# EAGLE design NANOmax (EAGLE 9.6.2)
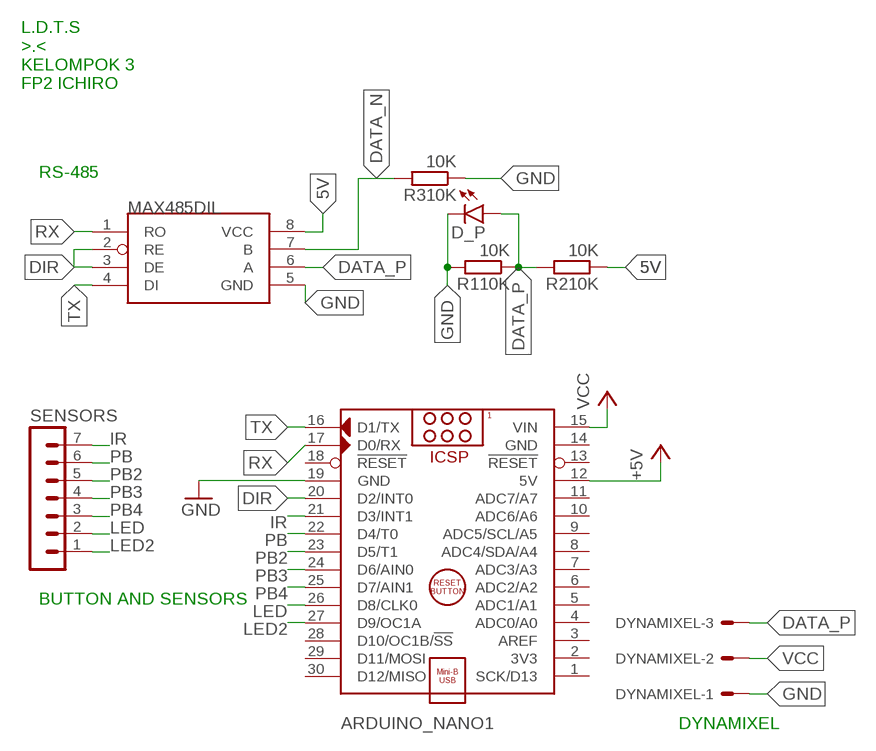
[diagram p0: schematic, sheet 1]

## Parts
ARDUINO_NANO1  ARDUINO_NANO  [ARDUINO_NANO]
D_P  LED3MM  [LED3MM]
DYNAMIXEL  22-27-2031-03  [6410-03]
MAX485  MAX485DIL  [DIL08]
R110K  10K  R-EU_0204/7  [0204/7]
R210K  10K  R-EU_0204/7  [0204/7]
R310K  10K  R-EU_0204/7  [0204/7]
SENSORS  MA07-1  [MA07-1]

## Nets
5V: MAX485.8(VCC) R210K.1
+5V: ARDUINO_NANO1.12(5V)
DATA_N: MAX485.7(B) R310K.2
DATA_P: D_P.A DYNAMIXEL.3 MAX485.6(A) R110K.1 R210K.2
DIR: ARDUINO_NANO1.20(D2/INT0) MAX485.2(RE) MAX485.3(DE)
GND: ARDUINO_NANO1.19(GND) D_P.K(C) DYNAMIXEL.1 MAX485.5(GND) R110K.2 R310K.1
IR: ARDUINO_NANO1.21(D3/INT1) SENSORS.7
LED: ARDUINO_NANO1.26(D8/CLK0) SENSORS.2
LED2: ARDUINO_NANO1.27(D9/OC1A) SENSORS.1
PB: ARDUINO_NANO1.22(D4/T0) SENSORS.6
PB2: ARDUINO_NANO1.23(D5/T1) SENSORS.5
PB3: ARDUINO_NANO1.24(D6/AIN0) SENSORS.4
PB4: ARDUINO_NANO1.25(D7/AIN1) SENSORS.3
RX: ARDUINO_NANO1.17(D0/RX) MAX485.1(RO)
TX: ARDUINO_NANO1.16(D1/TX) MAX485.4(DI)
VCC: ARDUINO_NANO1.15(VIN) DYNAMIXEL.2
Unconnected: ARDUINO_NANO1.1(SCK/D13) ARDUINO_NANO1.2(3V3) ARDUINO_NANO1.3(AREF) ARDUINO_NANO1.4(ADC0/A0) ARDUINO_NANO1.5(ADC1/A1) ARDUINO_NANO1.6(ADC2/A2) ARDUINO_NANO1.7(ADC3/A3) ARDUINO_NANO1.8(ADC4/SDA/A4) ARDUINO_NANO1.9(ADC5/SCL/A5) ARDUINO_NANO1.10(ADC6/A6) ARDUINO_NANO1.11(ADC7/A7) ARDUINO_NANO1.13(!RESET) ARDUINO_NANO1.18(!RESET) ARDUINO_NANO1.28(D10/OC1B/!SS) ARDUINO_NANO1.29(D11/MOSI) ARDUINO_NANO1.30(D12/MISO)

## Notes on the sheet
- L.D.T.S
  >.<
  KELOMPOK 3
  FP2 ICHIRO
- RS-485
- BUTTON AND SENSORS
- DYNAMIXEL

## Power pins joined to a net without a drawn wire
GND: ARDUINO_NANO1.14(GND)

## Library data of the parts
ARDUINO_NANO1 = ArduinoNanoV30:ARDUINO_NANO: Arduino Nano V3.0 Module Overview: The Arduino Nano is a small, complete, and breadboard-friendly board based on the ATmega328 (Arduino Nano 3.x) or ATmega168 (Arduino Nano 2.x). It has more or less the same functionality of the Arduino Duemilanove, but in a different package. It lacks only a DC power jack, and works with a Mini-B USB cable instead of a standard one. The Nano was designed and is being produced by Gravitech <http://www.gravitech.us/arna30wiatp.html>. General specifications: Item Value Microcontroller Atmel ATmega168 or ATmega328 Operating Voltage (logic level) 5 V Input Voltage (recommended) 7-12 V Input Voltage (limits) 6-20 V Digital I/O Pins 14 (of which 6 provide PWM output) Analog Input Pins 8 DC Current per I/O Pin 40 mA Flash Memory 16 KB (ATmega168) or 32 KB (ATmega328) of which 2 KB used by bootloader SRAM 1 KB (ATmega168) or 2 KB (ATmega328) EEPROM 512 bytes (ATmega168) or 1 KB (ATmega328) Clock Speed 16 MHz Dimensions (Inches) 0.73" x 1.70" Dimensions (mm) 18mm x 45mm Overall height About 9 mm (not including pins) Weigth 5 g Power: The Arduino Nano can be powered via the Mini-B USB connection, 6-20V unregulated external power supply (pin 30), or 5V regulated external power supply (pin 27). The power source is automatically selected to the highest voltage source. Memory: The ATmega168 has 16 KB of flash memory for storing code (of which 2 KB is used for the bootloader); the ATmega328 has 32 KB, (also with 2 KB used for the bootloader). The ATmega168 has 1 KB of SRAM and 512 bytes of EEPROM (which can be read and written with the EEPROM library); the ATmega328 has 2 KB of SRAM and 1 KB of EEPROM. Input and Output: Each of the 14 digital pins on the Nano can be used as an input or output, using pinMode(), digitalWrite(), and digitalRead() functions. They operate at 5 volts. Each pin can provide or receive a maximum of 40 mA and has an internal pull-up resistor (disconnected by default) of 20-50 kOhms. In addition, some pins have specialized functions. Visit Arduino - ArduinoBoardNano <https://www.arduino.cc/en/Main/ArduinoBoardNano>
D_P = led:LED: LED OSRAM: - CHIPLED LG R971, LG N971, LY N971, LG Q971, LY Q971, LO R971, LY R971 LH N974, LH R974 LS Q976, LO Q976, LY Q976 LO Q996 - Hyper CHIPLED LW Q18S LB Q993, LB Q99A, LB R99A - SideLED LS A670, LO A670, LY A670, LG A670, LP A670 LB A673, LV A673, LT A673, LW A673 LH A674 LY A675 LS A676, LA A676, LO A676, LY A676, LW A676 LS A679, LY A679, LG A679 - Hyper Micro SIDELED® LS Y876, LA Y876, LO Y876, LY Y876 LT Y87S - SmartLED LW L88C, LW L88S LB L89C, LB L89S, LG L890 LS L89K, LO L89K, LY L89K LS L896, LA L896, LO L896, LY L896 - TOPLED LS T670, LO T670, LY T670, LG T670, LP T670 LSG T670, LSP T670, LSY T670, LOP T670, LYG T670 LG T671, LOG T671, LSG T671 LB T673, LV T673, LT T673, LW T673 LH T674 LS T676, LA T676, LO T676, LY T676, LB T676, LH T676, LSB T676, LW T676 LB T67C, LV T67C, LT T67C, LS T67K, LO T67K, LY T67K, LW E67C LS E67B, LA E67B, LO E67B, LY E67B, LB E67C, LV E67C, LT E67C LW T67C LS T679, LY T679, LG T679 LS T770, LO T770, LY T770, LG T770, LP T770 LB T773, LV T773, LT T773, LW T773 LH T774 LS E675, LA E675, LY E675, LS T675 LS T776, LA T776, LO T776, LY T776, LB T776 LHGB T686 LT T68C, LB T68C - Hyper Mini TOPLED® LB M676 - Mini TOPLED Santana® LG M470 LS M47K, LO M47K, LY M47K Source: http://www.osram.convergy.de LUXEON: - LUMILED® LXK2-PW12-R00, LXK2-PW12-S00, LXK2-PW14-U00, LXK2-PW14-V00 LXK2-PM12-R00, LXK2-PM12-S00, LXK2-PM14-U00 LXK2-PE12-Q00, LXK2-PE12-R00, LXK2-PE12-S00, LXK2-PE14-T00, LXK2-PE14-U00 LXK2-PB12-K00, LXK2-PB12-L00, LXK2-PB12-M00, LXK2-PB14-N00, LXK2-PB14-P00, LXK2-PB14-Q00 LXK2-PR12-L00, LXK2-PR12-M00, LXK2-PR14-Q00, LXK2-PR14-R00 LXK2-PD12-Q00, LXK2-PD12-R00, LXK2-PD12-S00 LXK2-PH12-R00, LXK2-PH12-S00 LXK2-PL12-P00, LXK2-PL12-Q00, LXK2-PL12-R00 Source: www.luxeon.com KINGBRIGHT: KA-3528ASYC Source: www.kingbright.com
DYNAMIXEL = con-molex:22-?-03: CONNECTOR wire to board 2.54 mm (.1 inch) pitch header; MF: MOLEX; OC_FARNELL: unknown; OC_NEWARK: unknown
MAX485 = MAX485:MAX485: Check availability <https://pricing.snapeda.com/parts/MAX485/Maxim%20Integrated/view-part?ref=eda>; AVAILABILITY: In Stock; DESCRIPTION: 1/1 Transceiver Half RS422, RS485 8-uMAX-EP|8-uSOP-EP; MF: Maxim Integrated; MP: MAX485; PACKAGE: None; PRICE: None; PURCHASE-URL: https://pricing.snapeda.com/search/part/MAX485/?ref=eda
R110K R210K R310K = rcl:R-EU_: RESISTOR, European symbol; SPICEPREFIX: R
SENSORS = con-lstb:MA07-1: PIN HEADER; OC_FARNELL: unknown; OC_NEWARK: unknown

## Board
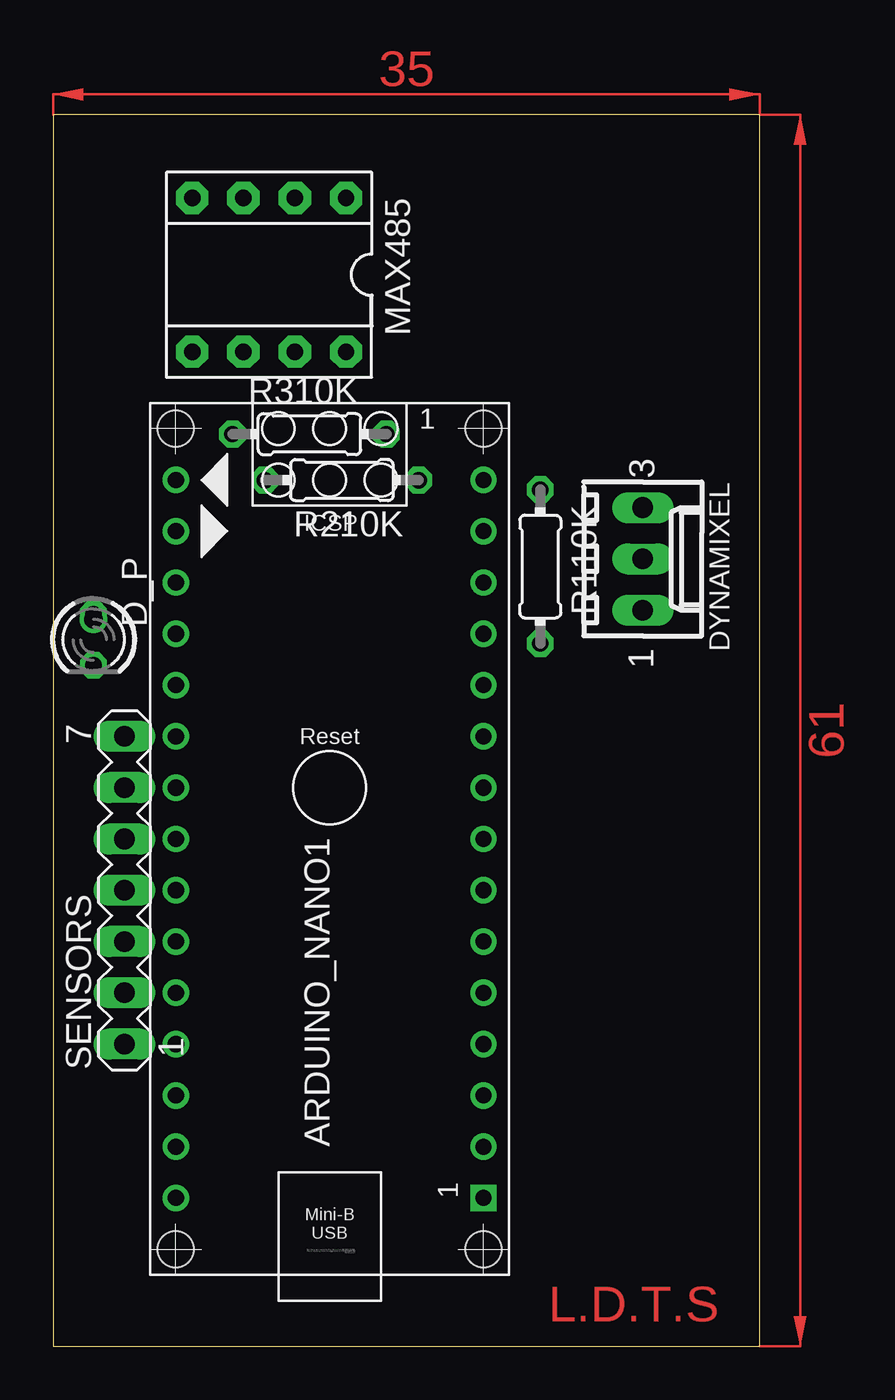
[diagram p1: board, top side]
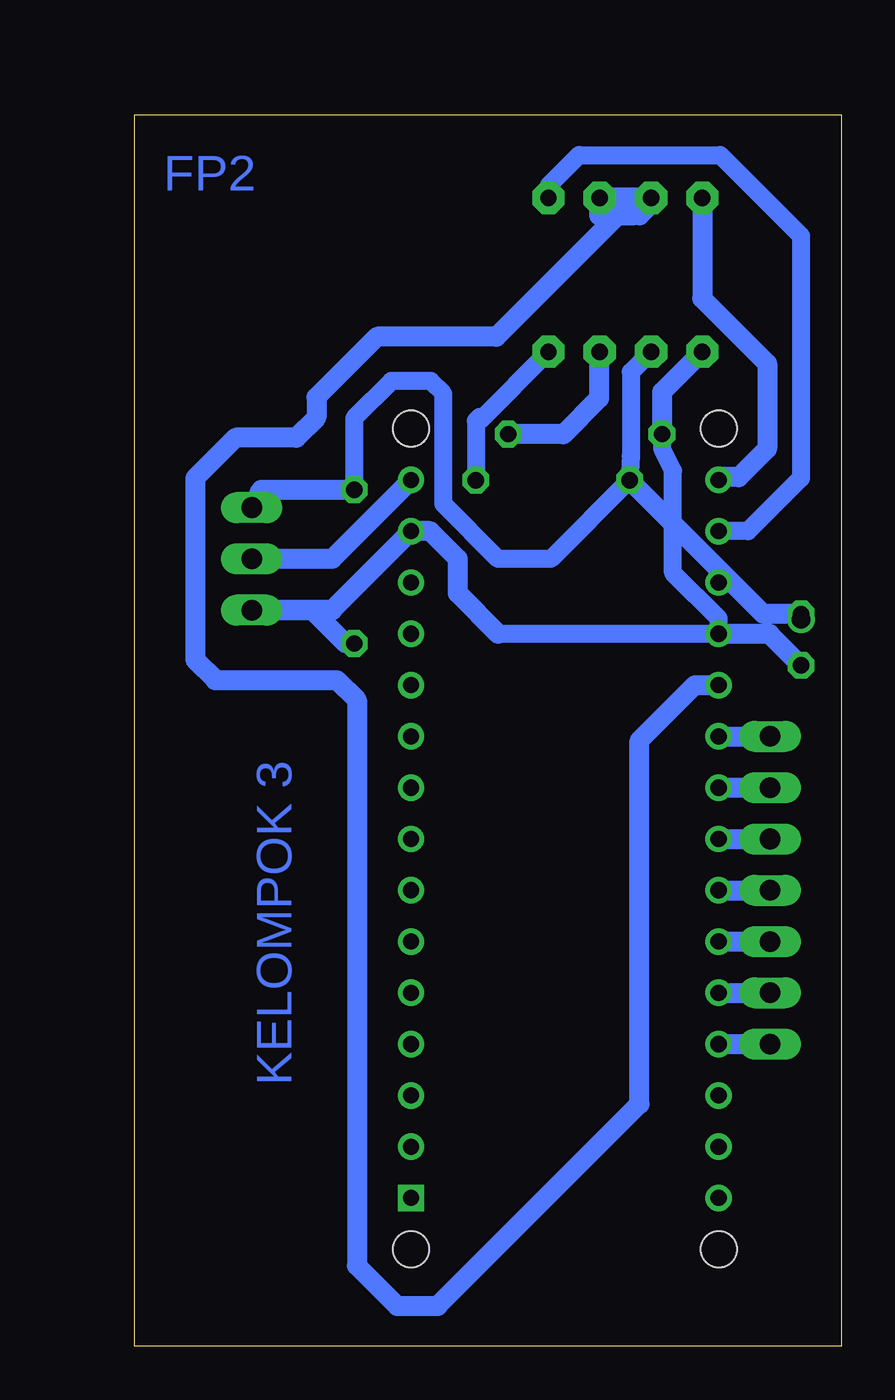
[diagram p2: board, bottom side, seen from below]

Size 35 x 61 mm. Coordinates in mm from the lower left corner, seen from the top.
Outline: 0,0 35,0 35,61 0,61 0,0
Copper layers (1*16): Top 0.035mm / dielectric 1.5mm / Bottom 0.035mm
Design rules "default": minimum track width 6mil, minimum drill 0.35mm, track to track 6mil, track to pad 6mil, pad to pad 6mil, via to via 6mil, smd to smd 6mil, copper to edge 40mil, drill to drill 6mil, minimum pad ring 10mil, minimum via ring 8mil, stop-mask expansion 4mil, vias tented up to drill 0mil, thermal gap 10mil

### Footprints (pad centres in the part's own frame; a part is rotated, then mirrored left to right if it is on the bottom)
ARDUINO_NANO = drill 0.8 square: 1 -20.32,-7.62 | drill 0.8: 2 -17.78,-7.62; 3 -15.24,-7.62; 4 -12.7,-7.62; 5 -10.16,-7.62; 6 -7.62,-7.62; 7 -5.08,-7.62; 8 -2.54,-7.62; 9 0,-7.62; 10 2.54,-7.62; 11 5.08,-7.62; 12 7.62,-7.62; 13 10.16,-7.62; 14 12.7,-7.62; 15 15.24,-7.62; 16 15.24,7.62; 17 12.7,7.62; 18 10.16,7.62; 19 7.62,7.62; 20 5.08,7.62; 21 2.54,7.62; 22 0,7.62; 23 -2.54,7.62; 24 -5.08,7.62; 25 -7.62,7.62; 26 -10.16,7.62; 27 -12.7,7.62; 28 -15.24,7.62; 29 -17.78,7.62; 30 -20.32,7.62 | hole 1.778: -22.86,-7.62; -22.86,7.62; 17.78,7.62; 17.78,-7.62
LED3MM = drill 0.813 octagon: A -1.27,0; K 1.27,0
6410-03 = drill 1.016 long: 1 2.54,0; 2 0,0; 3 -2.54,0
DIL08 = drill 0.813 pad 1.6 octagon: 1 -3.81,-3.81; 2 -1.27,-3.81; 3 1.27,-3.81; 4 3.81,-3.81; 5 3.81,3.81; 6 1.27,3.81; 7 -1.27,3.81; 8 -3.81,3.81
0204/7 = drill 0.813 octagon: 1 -3.81,0; 2 3.81,0
MA07-1 = drill 1.016 long: 1 -7.62,0; 2 -5.08,0; 3 -2.54,0; 4 0,0; 5 2.54,0; 6 5.08,0; 7 7.62,0

### Placement (x,y rotation side)
ARDUINO_NANO1  13.7,27.67 90 top
D_P  2,35 270 top
DYNAMIXEL  29.21,39 270 top
MAX485  10.7,53.07 180 top
R110K  24.13,38.62 270 top
R210K  14.3,42.9 180 top
R310K  12.7,45.18 0 top
SENSORS  3.54,22.59 90 top

### Tracks (layer width: path | path; a pad name or v marks a point on that pad's centre or on a via)
5V
  Bottom 0.9: MAX485.8 17.91,45.86 17.91,46.04 18.11,45.84 R210K.1
DATA_N
  Bottom 1: MAX485.7 12,49.23 12,46.96 13.78,45.18 R310K.2
DATA_P
  Bottom 0.9: MAX485.6 10.43,48.26 10.43,44.11 R210K.2 14.39,39 17,39 19.72,41.72 19.72,47.18 20.34,47.8 22.3,47.8 24.13,45.97 R110K.1
  Bottom 1: DYNAMIXEL.3 29.05,41.7 28.73,42.43 R110K.1 | MAX485.6 9.74,49.26 | D_P.A 3.86,36.27 R210K.2
DIR
  Bottom 1: ARDUINO_NANO1.20 7.25,32.75 10,30 10,12 20,2 22,2 24,4 24,32 25,33 31,33 32,34 32,43 30,45 27,45 26,46 26,47 23,50 17.09,50 11.09,56 10.31,56 MAX485.3 | MAX485.3 MAX485.2 | MAX485.2 12,56.85 12,56 11.97,56.03 MAX485.2 | MAX485.3 9.43,56.57 10,56
GND
  Bottom 0.9: 17,35.29 ARDUINO_NANO1.19 6.08,36.05 8.34,38.31 8.34,43.35 8.89,44.47 R310K.1
  Bottom 1: 24.56,34.81 26.21,36.46 DYNAMIXEL.1 25.23,36.46 ARDUINO_NANO1.14 20.37,40.37 19,39 19,37.29 17,35.29 | 24.56,34.81 | 24.56,34.81 R110K.2 | R310K.1 8.89,47.26 MAX485.5 | D_P.K 3.56,35.29 ARDUINO_NANO1.19
IR
  Bottom 1: ARDUINO_NANO1.21 SENSORS.7
LED
  Bottom 1: ARDUINO_NANO1.26 SENSORS.2
LED2
  Bottom 1: ARDUINO_NANO1.27 SENSORS.1
PB
  Bottom 1: ARDUINO_NANO1.22 SENSORS.6
PB2
  Bottom 1: ARDUINO_NANO1.23 SENSORS.5
PB3
  Bottom 1: ARDUINO_NANO1.24 SENSORS.4
PB4
  Bottom 1: ARDUINO_NANO1.25 SENSORS.3
RX
  Bottom 0.9: MAX485.1 14.51,57.49 13,59 6,59 2,55 2,43 4.63,40.37 ARDUINO_NANO1.17
S$1  (via drill 0.9)
  other vias: 2,36
TX
  Bottom 1: MAX485.4 6.89,51.89 3.67,48.67 3.67,44.45 5.08,43.05 5.95,43.05 ARDUINO_NANO1.16
VCC
  Bottom 1: ARDUINO_NANO1.15 25.23,39 DYNAMIXEL.2
(copper drawn outside any net)
  shapes: Top area x2

### Text on the board
Top: L.D.T.S
Bottom: FP2 | KELOMPOK 3